# EAGLE design controller (EAGLE 6.4)
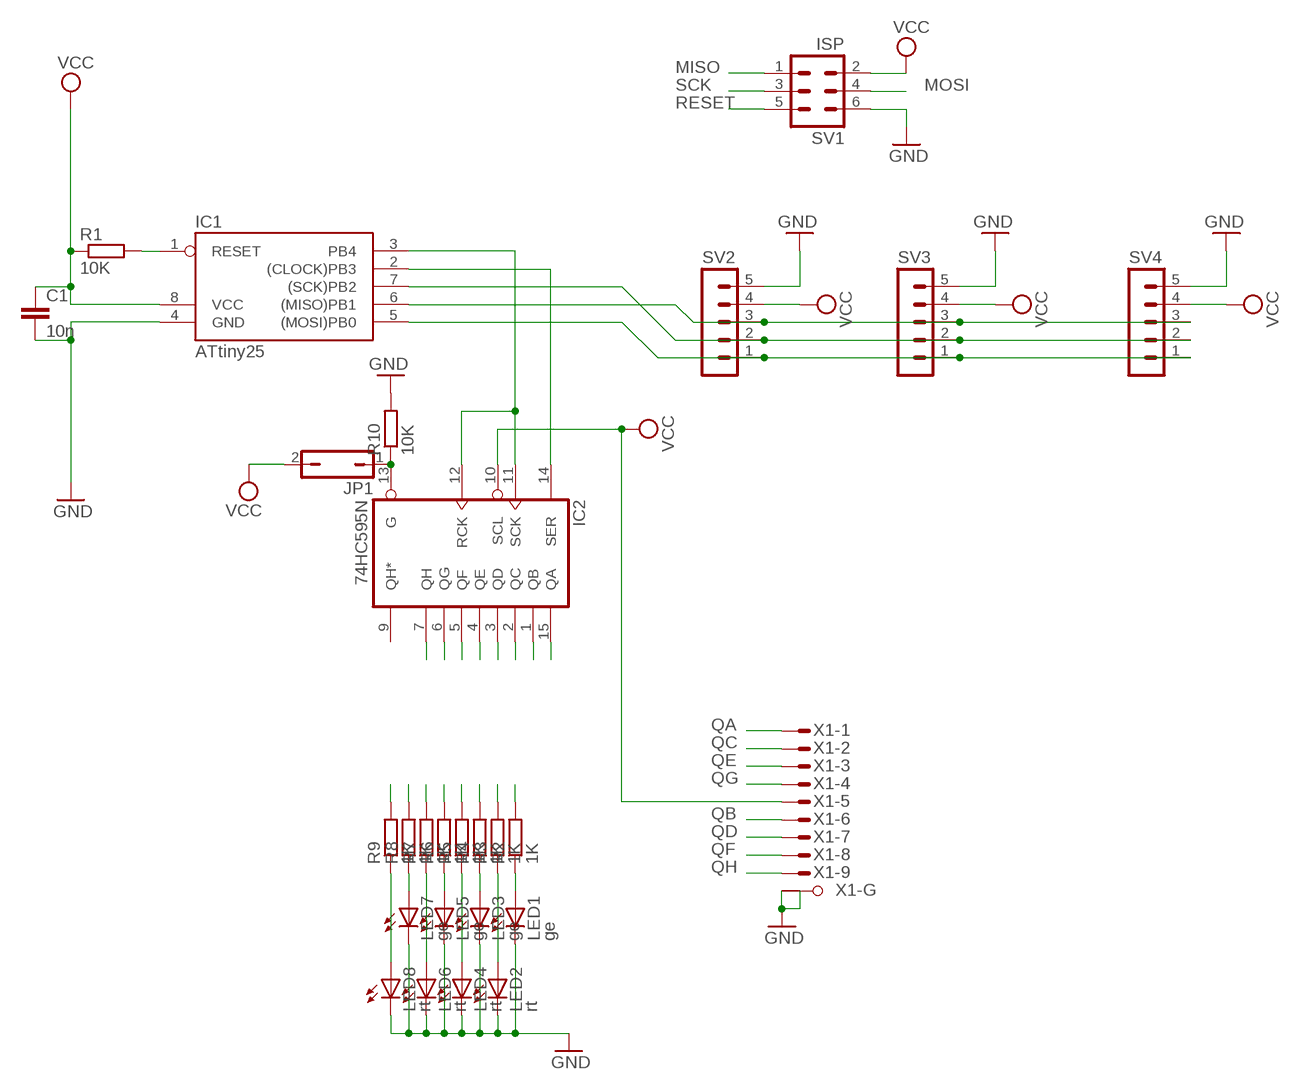
[diagram p0: schematic, sheet 1]

## Parts
C1  10n  C-EU025-024X044  [C025-024X044]
IC1  ATtiny25  AT90S2343P  [DIL08]
IC2  74HC595N  [DIL16]
JP1  JP1Q  [JP1]
LED1  ge  LED5MM  [LED5MM]
LED2  rt  LED5MM  [LED5MM]
LED3  ge  LED5MM  [LED5MM]
LED4  rt  LED5MM  [LED5MM]
LED5  ge  LED5MM  [LED5MM]
LED6  rt  LED5MM  [LED5MM]
LED7  ge  LED5MM  [LED5MM]
LED8  rt  LED5MM  [LED5MM]
R1  10K  R-EU_0207/7  [0207/7]
R2  1K  R-EU_0309/12  [0309/12]
R3  1K  R-EU_0309/12  [0309/12]
R4  1K  R-EU_0309/12  [0309/12]
R5  1K  R-EU_0309/12  [0309/12]
R6  1K  R-EU_0309/12  [0309/12]
R7  1K  R-EU_0309/12  [0309/12]
R8  1K  R-EU_0309/12  [0309/12]
R9  1K  R-EU_0309/12  [0309/12]
R10  10K  R-EU_0207/7  [0207/7]
SV1  ISP  MA03-2  [MA03-2]
SV2  MA05-1  [MA05-1]
SV3  MA05-1  [MA05-1]
SV4  MA05-1  [MA05-1]
X1  M09HPS  [M09HP]

## Nets
GND: C1.2 IC1.4(GND) LED1.K(C) LED2.K(C) LED3.K(C) LED4.K(C) LED5.K(C) LED6.K(C) LED7.K(C) LED8.K(C) R10.2 SV1.6 SV2.5 SV3.5 SV4.5 X1.G1(-G:G1) X1.G2(-G:G2)
MISO: IC1.6((MISO)PB1) SV1.1 SV2.3 SV3.3 SV4.3
MOSI: IC1.5((MOSI)PB0) SV1.4 SV2.1 SV3.1 SV4.1
N$2: IC1.2((CLOCK)PB3) IC2.14(SER)
N$3: IC1.3(PB4) IC2.11(SCK) IC2.12(RCK)
N$5: LED1.A R2.1
N$6: LED2.A R3.1
N$7: LED3.A R4.1
N$8: LED4.A R5.1
N$9: LED5.A R6.1
N$10: LED6.A R7.1
N$11: LED7.A R8.1
N$12: LED8.A R9.1
QA: IC2.15(QA) R2.2 X1.1(-1:M)
QB: IC2.1(QB) R6.2 X1.6(-6:M)
QC: IC2.2(QC) R3.2 X1.2(-2:M)
QD: IC2.3(QD) R7.2 X1.7(-7:M)
QE: IC2.4(QE) R4.2 X1.3(-3:M)
QF: IC2.5(QF) R8.2 X1.8(-8:M)
QG: IC2.6(QG) R5.2 X1.4(-4:M)
QH: IC2.7(QH) R9.2 X1.9(-9:M)
REG_DISABLE: IC2.13(G) JP1.1 R10.1
RESET: IC1.1(RESET) R1.2 SV1.5
SCK: IC1.7((SCK)PB2) SV1.3 SV2.2 SV3.2 SV4.2
VCC: C1.1 IC1.8(VCC) IC2.10(SCL) JP1.2 R1.1 SV1.2 SV2.4 SV3.4 SV4.4 X1.5(-5:M)
Unconnected: IC2.9(QH*)

## Power pins joined to a net without a drawn wire
GND: IC2.8(GND)
VCC: IC2.16(VCC)

## Library data of the parts
C1 = resistor:C-EU: CAPACITOR, European symbol
IC1 = atmel:AT90*2343: MICROCONTROLLER 2 Kbytes FLASH 128 bytes SRAM 128 bytes EEPROM; OC_FARNELL: unknown; OC_NEWARK: unknown
IC2 = 74xx-eu:74*595: 8-bit SHIFT REGISTER, output latch
JP1 = jumper:JP1Q: JUMPER
LED1-LED8 = led:LED: LED OSRAM: - CHIPLED LG R971, LG N971, LY N971, LG Q971, LY Q971, LO R971, LY R971 LH N974, LH R974 LS Q976, LO Q976, LY Q976 LO Q996 - Hyper CHIPLED LW Q18S LB Q993, LB Q99A, LB R99A - SideLED LS A670, LO A670, LY A670, LG A670, LP A670 LB A673, LV A673, LT A673, LW A673 LH A674 LY A675 LS A676, LA A676, LO A676, LY A676, LW A676 LS A679, LY A679, LG A679 - Hyper Micro SIDELED® LS Y876, LA Y876, LO Y876, LY Y876 LT Y87S - SmartLED LW L88C, LW L88S LB L89C, LB L89S, LG L890 LS L89K, LO L89K, LY L89K LS L896, LA L896, LO L896, LY L896 - TOPLED LS T670, LO T670, LY T670, LG T670, LP T670 LSG T670, LSP T670, LSY T670, LOP T670, LYG T670 LG T671, LOG T671, LSG T671 LB T673, LV T673, LT T673, LW T673 LH T674 LS T676, LA T676, LO T676, LY T676, LB T676, LH T676, LSB T676, LW T676 LB T67C, LV T67C, LT T67C, LS T67K, LO T67K, LY T67K, LW E67C LS E67B, LA E67B, LO E67B, LY E67B, LB E67C, LV E67C, LT E67C LW T67C LS T679, LY T679, LG T679 LS T770, LO T770, LY T770, LG T770, LP T770 LB T773, LV T773, LT T773, LW T773 LH T774 LS E675, LA E675, LY E675, LS T675 LS T776, LA T776, LO T776, LY T776, LB T776 LHGB T686 LT T68C, LB T68C - Hyper Mini TOPLED® LB M676 - Mini TOPLED Santana® LG M470 LS M47K, LO M47K, LY M47K Source: http://www.osram.convergy.de LUXEON: - LUMILED® LXK2-PW12-R00, LXK2-PW12-S00, LXK2-PW14-U00, LXK2-PW14-V00 LXK2-PM12-R00, LXK2-PM12-S00, LXK2-PM14-U00 LXK2-PE12-Q00, LXK2-PE12-R00, LXK2-PE12-S00, LXK2-PE14-T00, LXK2-PE14-U00 LXK2-PB12-K00, LXK2-PB12-L00, LXK2-PB12-M00, LXK2-PB14-N00, LXK2-PB14-P00, LXK2-PB14-Q00 LXK2-PR12-L00, LXK2-PR12-M00, LXK2-PR14-Q00, LXK2-PR14-R00 LXK2-PD12-Q00, LXK2-PD12-R00, LXK2-PD12-S00 LXK2-PH12-R00, LXK2-PH12-S00 LXK2-PL12-P00, LXK2-PL12-Q00, LXK2-PL12-R00 Source: www.luxeon.com KINGBRIGHT: KA-3528ASYC Source: www.kingbright.com
R1-R10 = resistor:R-EU_: RESISTOR, European symbol
SV1 = con-lstb:MA03-2: PIN HEADER; OC_FARNELL: unknown; OC_NEWARK: unknown
SV2-SV4 = con-lstb:MA05-1: PIN HEADER; OC_FARNELL: unknown; OC_NEWARK: unknown
X1 = con-subd:M09HPS: SUB-D; OC_FARNELL: unknown; OC_NEWARK: unknown

## Board
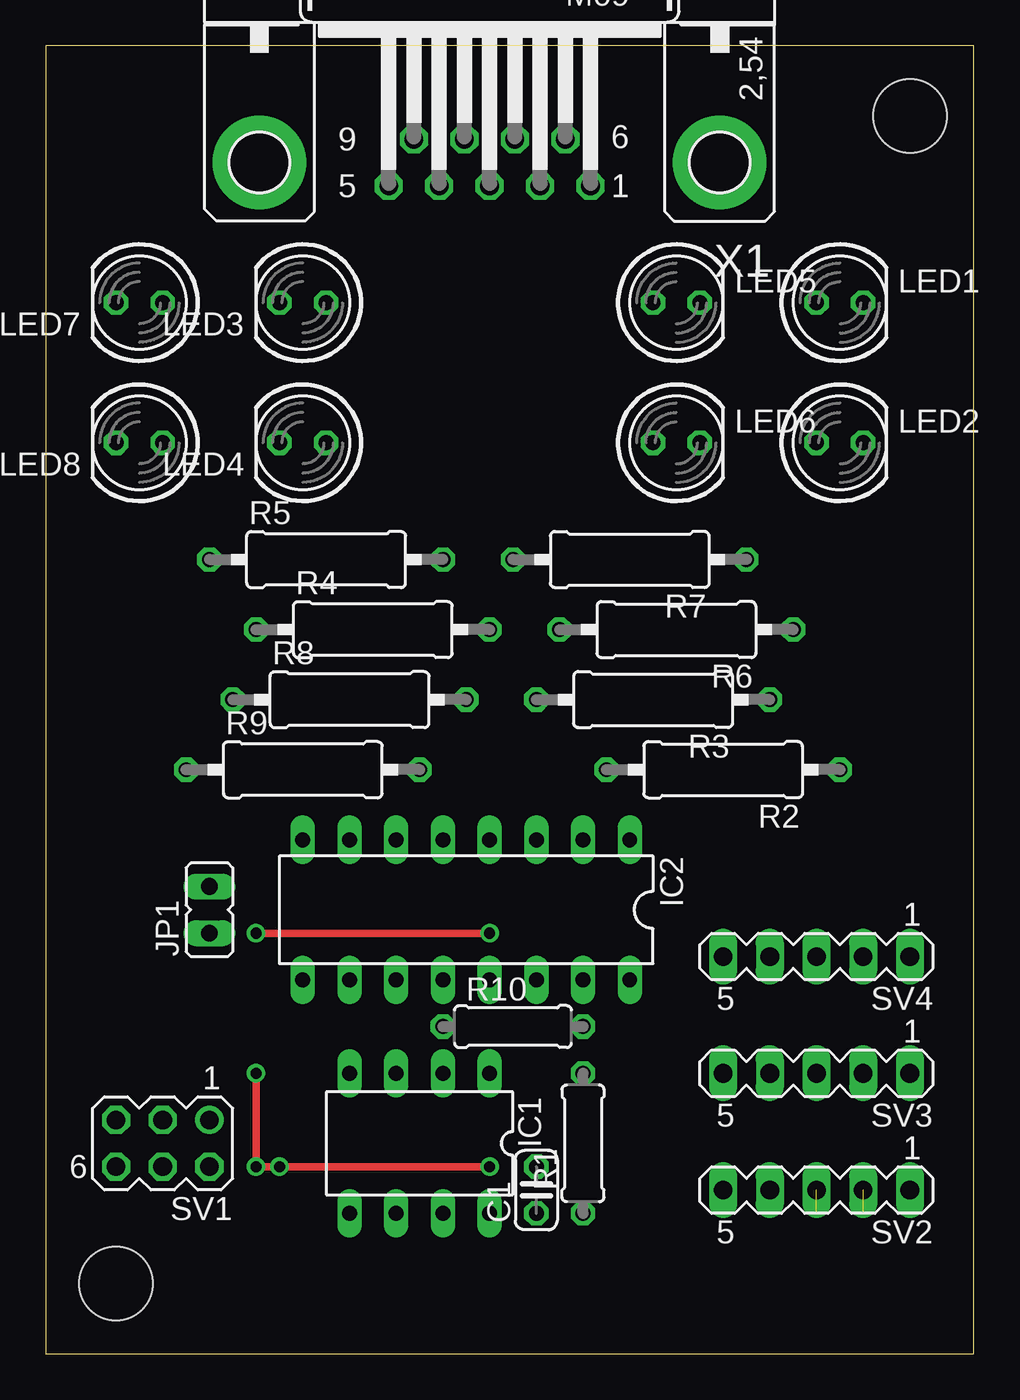
[diagram p1: board, top side]
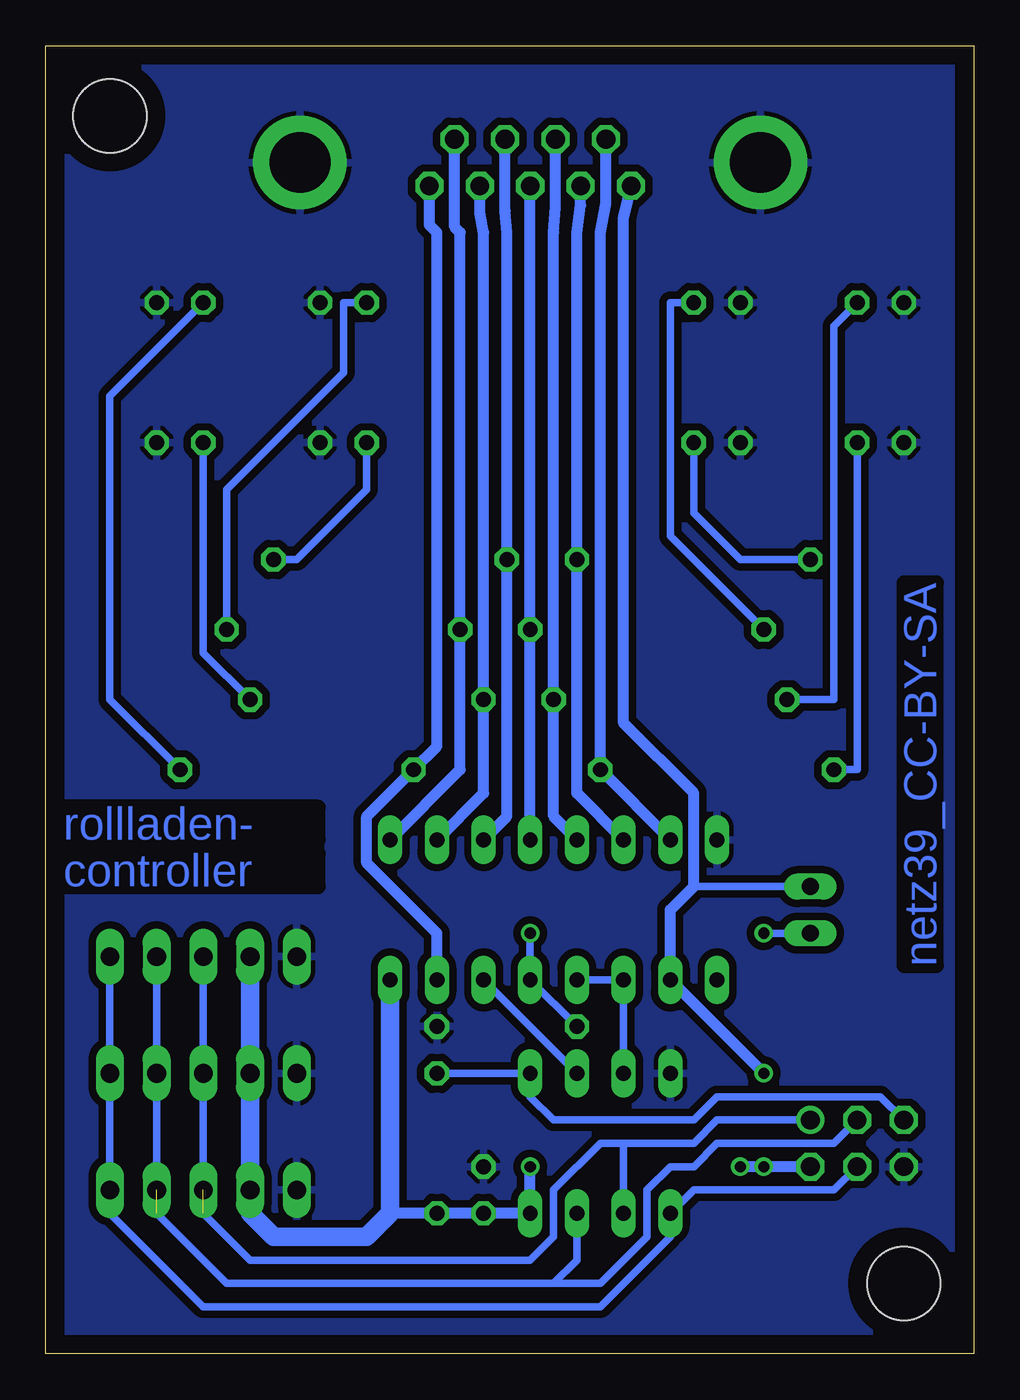
[diagram p2: board, bottom side, seen from below]

Size 50.47 x 71.11 mm. Coordinates in mm from the lower left corner, seen from the top.
Outline: 0,0 50.47,0 50.47,71.11 0,71.11 0,0
Copper layers (1*16): Top 0.035mm / dielectric 1.5mm / Bottom 0.035mm
Design rules "default *": minimum track width 10mil, minimum drill 24mil, track to track 10mil, track to pad 10mil, pad to pad 10mil, via to via 10mil, smd to smd 8mil, copper to edge 40mil, drill to drill 8mil, minimum pad ring 10mil, minimum via ring 8mil, stop-mask expansion 4mil, vias tented up to drill 0mil, thermal gap 10mil
Holes 4 mm at 3.81,3.81 46.99,67.31

### Footprints (pad centres in the part's own frame; a part is rotated, then mirrored left to right if it is on the bottom)
C025-024X044 = drill 0.813 octagon: 1 -1.27,0; 2 1.27,0
DIL08 = drill 0.813 long: 1 -3.81,-3.81; 2 -1.27,-3.81; 3 1.27,-3.81; 4 3.81,-3.81; 5 3.81,3.81; 6 1.27,3.81; 7 -1.27,3.81; 8 -3.81,3.81
DIL16 = drill 0.813 long: 1 -8.89,-3.81; 2 -6.35,-3.81; 3 -3.81,-3.81; 4 -1.27,-3.81; 5 1.27,-3.81; 6 3.81,-3.81; 7 6.35,-3.81; 8 8.89,-3.81; 9 8.89,3.81; 10 6.35,3.81; 11 3.81,3.81; 12 1.27,3.81; 13 -1.27,3.81; 14 -3.81,3.81; 15 -6.35,3.81; 16 -8.89,3.81
JP1 = drill 0.914 long: 1 0,-1.27; 2 0,1.27
LED5MM = drill 0.813 octagon: A -1.27,0; K 1.27,0
0207/7 = drill 0.813 octagon: 1 -3.81,0; 2 3.81,0
0309/12 = drill 0.813 octagon: 1 -6.35,0; 2 6.35,0
MA03-2 = drill 1.016: 1 -2.54,-1.27 | drill 1.016 octagon: 2 -2.54,1.27; 3 0,-1.27; 4 0,1.27; 5 2.54,-1.27; 6 2.54,1.27
MA05-1 = drill 1.016 long: 1 -5.08,0; 2 -2.54,0; 3 0,0; 4 2.54,0; 5 5.08,0
M09HP = drill 1.016 octagon: 1 -5.486,1.27; 2 -2.743,1.27; 3 0,1.27; 4 2.743,1.27; 5 5.486,1.27; 6 -4.115,-1.27; 7 -1.372,-1.27; 8 1.372,-1.27; 9 4.115,-1.27 | drill 3.302 pad 5.08: G1 -12.522,0; G2 12.522,0

### Placement (x,y rotation side)
C1  26.67,8.89 90 top
IC1  20.32,11.43 180 top
IC2  22.86,24.13 180 top
JP1  8.89,24.13 0 top
LED1  43.18,57.15 0 top
LED2  43.18,49.53 0 top
LED3  13.97,57.15 180 top
LED4  13.97,49.53 180 top
LED5  34.29,57.15 0 top
LED6  34.29,49.53 0 top
LED7  5.08,57.15 180 top
LED8  5.08,49.53 180 top
R1  29.21,11.43 90 top
R2  36.83,31.75 180 top
R3  33.02,35.56 180 top
R4  17.78,39.37 0 top
R5  15.24,43.18 0 top
R6  34.29,39.37 180 top
R7  31.75,43.18 180 top
R8  16.51,35.56 0 top
R9  13.97,31.75 0 top
R10  25.4,17.78 0 top
SV1  6.35,11.43 180 top
SV2  41.91,8.89 180 top
SV3  41.91,15.24 180 top
SV4  41.91,21.59 180 top
X1  24.13,64.77 180 top

### Tracks (layer width: path | path; a pad name or v marks a point on that pad's centre or on a via)
GND
  pour Bottom (isolate 0.406): 0,71.12 50.8,71.12 50.8,0 0,0
MISO  (1 unrouted)
  Bottom 0.406: 41.91,7.62 39.37,5.08 24.13,5.08 22.86,6.35 22.86,8.89 20.32,11.43 19.05,11.43 | 19.05,11.43 15.24,11.43 13.97,12.7 SV1.1 | SV2.3 SV3.3 SV4.3 | IC1.6 19.05,11.43
MOSI
  Bottom 0.406: SV1.4 7.62,8.89 15.24,8.89 IC1.5 16.51,6.35 20.32,2.54 41.91,2.54 46.99,7.62 SV2.1 SV3.1 SV4.1
N$2
  Bottom 0.406: IC1.2 IC2.14
N$3
  Bottom 0.406: IC1.3 IC2.11 IC2.12
N$5
  Bottom 0.406: R2.1 46.99,35.56 46.99,52.07 LED1.A
N$6
  Bottom 0.406: R3.1 41.91,38.1 LED2.A
N$7
  Bottom 0.406: LED3.A 16.51,57.15 16.51,44.45 R4.1
N$8
  Bottom 0.406: LED4.A 15.24,45.72 12.7,43.18 R5.1
N$9
  Bottom 0.406: LED5.A 34.29,57.15 34.29,53.34 40.64,46.99 R6.1
N$10
  Bottom 0.406: R7.1 36.83,43.18 33.02,46.99 LED6.A
N$11
  Bottom 0.406: LED7.A 7.62,55.88 7.62,35.56 R8.1
N$12
  Bottom 0.406: LED8.A 6.35,31.75 R9.1
N$13  (via drill 0.6 pad 0.81)
  other vias: 11.43,10.16
QA
  Bottom 0.61: IC2.15 29.21,22.86 33.02,26.67 33.02,29.21 R2.2 29.21,33.02 29.21,60.96 29.62,61.37 X1.1
QB
  Bottom 0.61: IC2.1 27.94,31.75 R6.2 27.94,60.96 28.25,61.27 X1.6
QC
  Bottom 0.61: IC2.2 26.67,30.48 R3.2 26.67,60.96 26.87,62.03 X1.2
QD
  Bottom 0.61: IC2.3 25.4,29.21 R7.2 25.4,60.96 25.5,62.13 X1.7
QE
  Bottom 0.61: IC2.4 R4.2 X1.3
QF
  Bottom 0.61: IC2.5 22.86,29.21 R8.2 22.86,60.96 22.76,62.33 X1.8
QG
  Bottom 0.61: IC2.6 21.59,30.48 R5.2 21.59,60.96 21.39,62.43 X1.4
QH
  Bottom 0.61: IC2.7 R9.2 20.32,60.96 20.02,62.53 X1.9
REG_DISABLE  (via drill 0.6)
  Top 0.406: v11.43,22.86 v24.13,22.86
  Bottom 0.406: R10.1 IC2.13 v24.13,22.86 | JP1.1 v11.43,22.86
RESET
  Bottom 0.406: R1.2 IC1.1 24.13,13.97 22.86,12.7 15.24,12.7 13.97,13.97 5.08,13.97 SV1.5
SCK  (1 unrouted)
  Bottom 0.406: 22.86,3.81 40.64,3.81 44.45,7.62 | 22.86,3.81 20.32,3.81 17.78,6.35 17.78,8.89 16.51,10.16 15.24,10.16 13.97,11.43 7.62,11.43 SV1.3 | SV2.2 SV3.2 SV4.2 | IC1.7 21.59,5.08 22.86,3.81
VCC  (via drill 0.6 pad 0.81)
  Top 0.406: v24.13,10.16 v12.7,10.16 11.43,10.16 v11.43,15.24
  Bottom 0.406: JP1.2 15.24,25.4 | SV2.4 39.37,7.62
  Bottom 0.61: X1.5 19.05,61.82 19.05,34.29 15.24,30.48 15.24,25.4 16.51,24.13 IC2.10 v11.43,15.24 | v24.13,10.16 IC1.8 C1.1 R1.1 31.75,7.62 | SV1.2 v12.7,10.16
  Bottom 1.016: SV2.4 SV3.4 SV4.4 | IC2.16 31.75,10.16 31.75,7.62 33.02,6.35 38.1,6.35 39.37,7.62

### Text on the board
Bottom: netz39_CC-BY-SA | rollladen- | controller